# EAGLE schematic stantion (EAGLE 8.5.2)
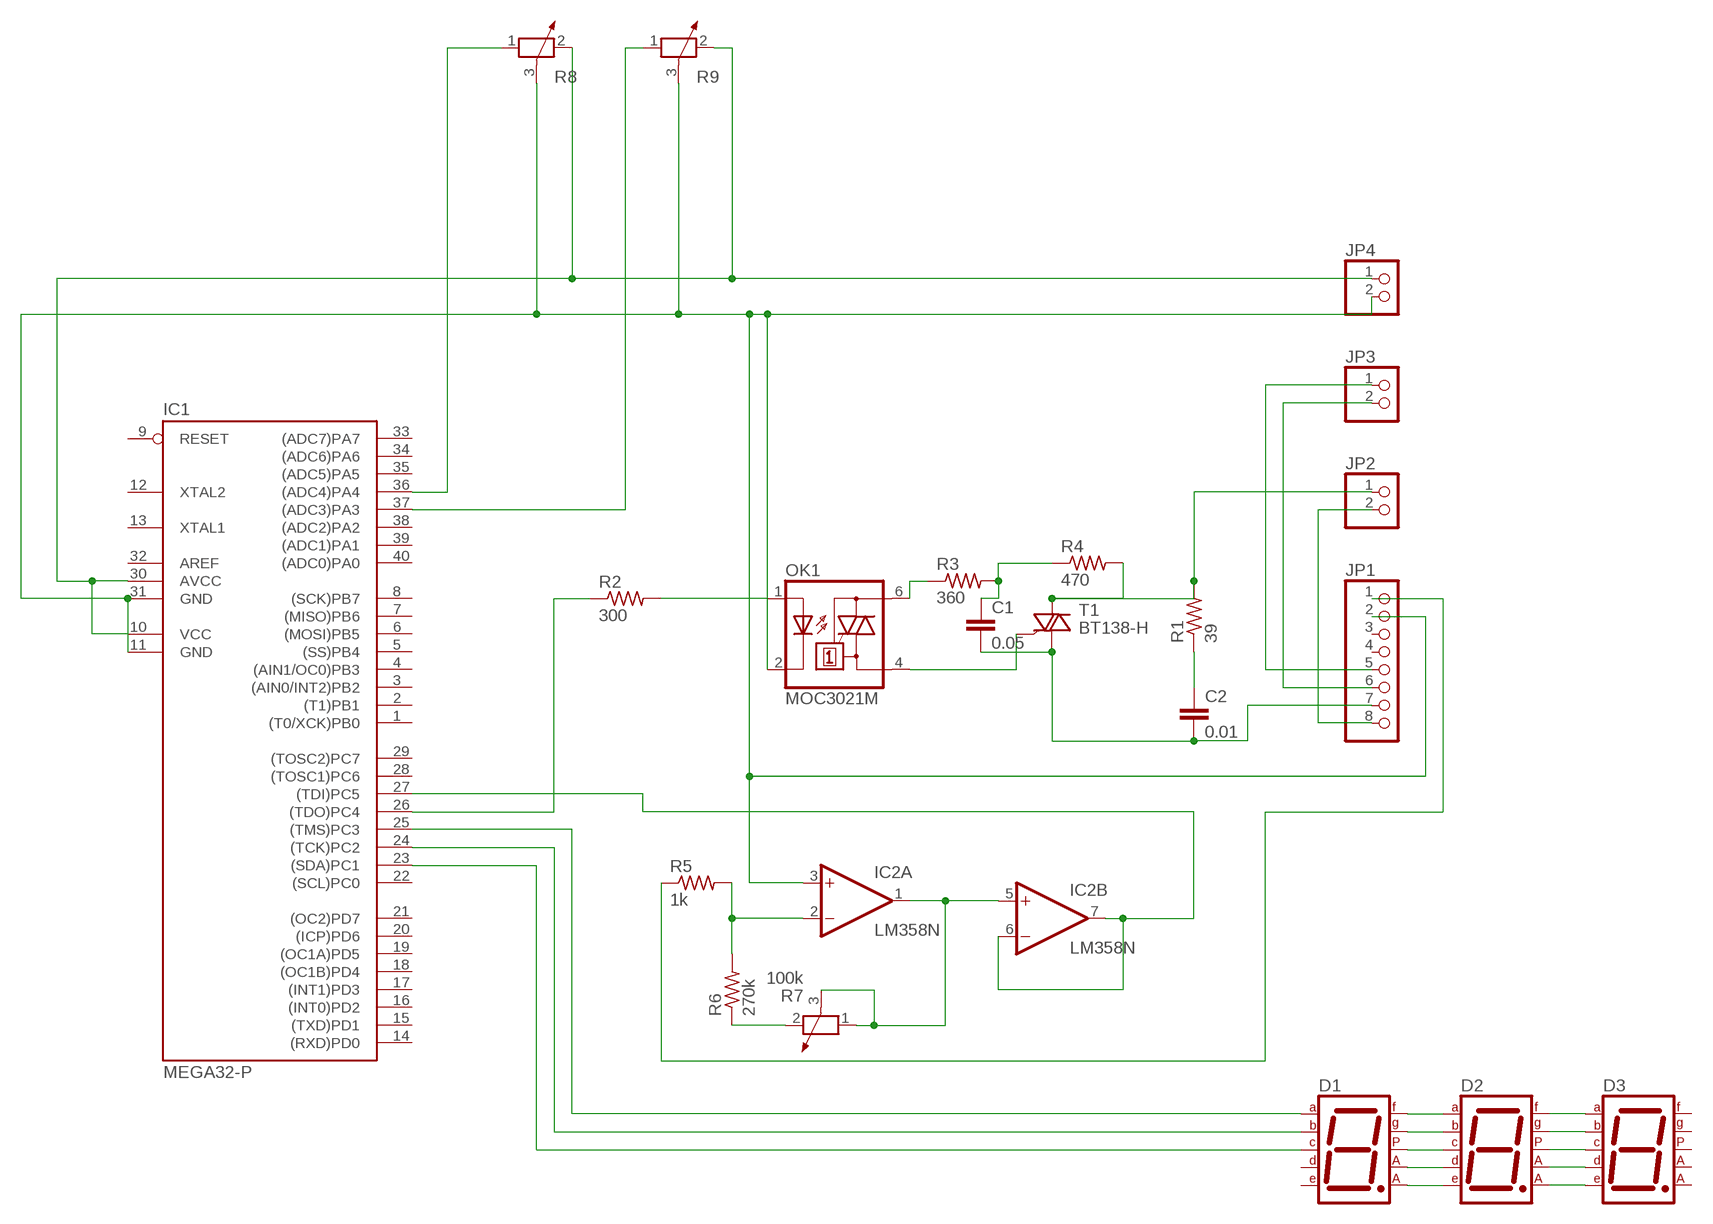
[diagram p0: schematic, sheet 1]

## Parts
C1  0.05  C-EU075-032X103  [C075-032X103]
C2  0.01  C-EU075-032X103  [C075-032X103]
D1  7SEG-CA  [7SEG-13]
D2  7SEG-CA  [7SEG-13]
D3  7SEG-CA  [7SEG-13]
IC1  MEGA32-P  [DIL40]
IC2  LM358N  [DIL08]
JP1  PINHD-1X8  [1X08]
JP2  PINHD-1X2  [1X02]
JP3  PINHD-1X2  [1X02]
JP4  PINHD-1X2  [1X02]
OK1  MOC3021M  [DIL06]
R1  39  R-US_V234/12  [V234/12]
R2  300  R-US_V234/12  [V234/12]
R3  360  R-US_V234/12  [V234/12]
R4  470  R-US_V234/12  [V234/12]
R5  1k  R-US_V234/12  [V234/12]
R6  270k  R-US_V234/12  [V234/12]
R7  100k  POTENTIOMETER_PT_SPIN  [PT-SPIN]
R8  POTENTIOMETER_PT-10  [PT-10]
R9  POTENTIOMETER_PT-10  [PT-10]
T1  BT138-H  [TO220BH]

## Nets
N$1: OK1.4(A1) T1.G
N$2: OK1.1(A) R2.2
N$3: OK1.6(A2) R3.1
N$4: C1.1 R3.2 R4.1
N$5: JP2.1 R1.2 R4.2 T1.T2(A2)
N$6: C2.1 R1.1
N$7: C1.2 C2.2 JP1.7 T1.T1(A1)
N$8: JP1.8 JP2.2
N$9: IC1.10(VCC) IC1.30(AVCC) JP4.1 R8.2 R9.2
N$10: IC1.26((TDO)PC4) R2.1
N$11: IC1.11(GND) IC1.31(GND) IC2.3(A:+IN) JP1.2 JP4.2 OK1.2(C) R8.3 R9.3
N$12: JP1.5 JP3.1
N$13: JP1.6 JP3.2
N$14: D1.9(F) D2.7(A)
N$15: D1.10(G) D2.6(B)
N$16: D1.5(DP) D2.4(C)
N$17: D1.3(CA1) D2.2(D)
N$18: D1.8(CA2) D2.1(E)
N$19: D2.9(F) D3.7(A)
N$20: D2.10(G) D3.6(B)
N$21: D2.5(DP) D3.4(C)
N$22: D2.3(CA1) D3.2(D)
N$23: D2.8(CA2) D3.1(E)
N$24: D1.7(A) IC1.25((TMS)PC3)
N$25: D1.6(B) IC1.24((TCK)PC2)
N$26: D1.4(C) IC1.23((SDA)PC1)
N$27: IC1.27((TDI)PC5) IC2.6(B:-IN) IC2.7(B:OUT)
N$28: IC2.1(A:OUT) IC2.5(B:+IN) R7.1 R7.3
N$29: IC2.2(A:-IN) R5.2 R6.2
N$30: IC1.36((ADC4)PA4) R8.1
N$31: R6.1 R7.2
N$32: JP1.1 R5.1
N$33: IC1.37((ADC3)PA3) R9.1
Unconnected: D1.1(E) D1.2(D) D3.3(CA1) D3.5(DP) D3.8(CA2) D3.9(F) D3.10(G) IC1.1((T0/XCK)PB0) IC1.2((T1)PB1) IC1.3((AIN0/INT2)PB2) IC1.4((AIN1/OC0)PB3) IC1.5((SS)PB4) IC1.6((MOSI)PB5) IC1.7((MISO)PB6) IC1.8((SCK)PB7) IC1.9(RESET) IC1.12(XTAL2) IC1.13(XTAL1) IC1.14((RXD)PD0) IC1.15((TXD)PD1) IC1.16((INT0)PD2) IC1.17((INT1)PD3) IC1.18((OC1B)PD4) IC1.19((OC1A)PD5) IC1.20((ICP)PD6) IC1.21((OC2)PD7) IC1.22((SCL)PC0) IC1.28((TOSC1)PC6) IC1.29((TOSC2)PC7) IC1.32(AREF) IC1.33((ADC7)PA7) IC1.34((ADC6)PA6) IC1.35((ADC5)PA5) IC1.38((ADC2)PA2) IC1.39((ADC1)PA1) IC1.40((ADC0)PA0) JP1.3 JP1.4

## Power pins joined to a net without a drawn wire
V+: IC2.8(P:V+)
V-: IC2.4(P:V-)

## Library data of the parts
C1 C2 = rcl:C-EU: CAPACITOR, European symbol; SPICEPREFIX: C
D1-D3 = special:7SEG-CA: 7-segment DISPLAY single anode, 13 mm
IC1 = atmel:MEGA32-P: MICROCONTROLLER 32 Kbytes FLASH 2 Kbytes SRAM 1 Kbytes EEPROM USART 8-channel 10 bit ADC Source: www.atmel.com .. doc2503.pdf; MPN: ATMEGA32-16PU; OC_FARNELL: 1661729; OC_NEWARK: 51P1794
IC2 = linear:LM358: OP AMP also LM158; LM258; LM2904 Source: http://cache.national.com/ds/LM/LM158.pdf
JP1 = pinhead:PINHD-1X8: PIN HEADER
JP2-JP4 = pinhead:PINHD-1X2: PIN HEADER
OK1 = optocoupler:MOC30*M: RANDOM-PHASE OPTOISOLATORS TRIAC DRIVER OUTPUT Source: http://www.fairchildsemi.com MOC3020-M.pdf; MF: FAIRCHILD SEMICONDUCTOR; MPN: MOC3021-M; OC_FARNELL: 1021365; OC_NEWARK: 95B7895
R1-R6 = rcl:R-US_: RESISTOR, American symbol; SPICEPREFIX: R
R7-R9 = rcl:POTENTIOMETER_: Potentiometer; SPICEMODEL: POT; SPICEPREFIX: X
T1 = triac:BT138: TRIAC Source: http://www.semiconductors.philips.com BT138_SERIES_2.pdf